# EAGLE schematic BreadBoard_Simple_Parallel_Resistive_Circuit (EAGLE 9.2.2)
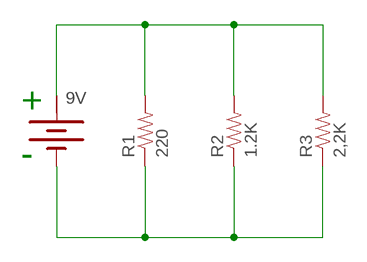
[diagram p0: schematic, sheet 1]

## Parts
BAT1  9V  BATTERY  [BATTERY]
R1  220  RESISTORPTH-1/4W  [AXIAL-0.4]
R2  1.2K  RESISTORPTH-1/4W  [AXIAL-0.4]
R3  2,2K  RESISTORPTH-1/4W  [AXIAL-0.4]

## Nets
N$1: BAT1.+ R1.P$2 R2.P$2 R3.P$2
N$2: BAT1.- R1.P$1 R2.P$1 R3.P$1

## Notes on the sheet
- +
- -

## Power pins joined to a net without a drawn wire
+: BAT1.+@1(+)

## Library data of the parts
BAT1 = special:BATTERY: BATTERY
R1-R3 = SparkFun-Resistors:RESISTOR: Resistor Basic schematic elements and footprints for 0603, 1206, and PTH resistors.